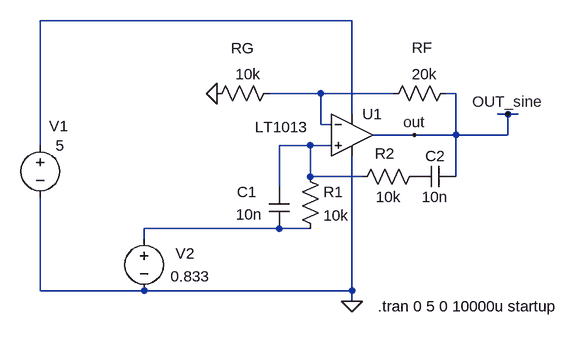
[diagram p0: schematic sine_wave_oscillators_8_wien_bridge_oscillator.asc]
sine_wave_oscillators_8_wien_bridge_oscillator.asc, the LTspice schematic file:
Version 4
SHEET 1 1496 680
WIRE 128 -16 -352 -16
WIRE 80 96 0 96
WIRE 192 96 80 96
WIRE 288 96 272 96
WIRE 128 128 128 -16
WIRE 368 128 352 128
WIRE 384 128 368 128
WIRE 80 144 80 96
WIRE 96 144 80 144
WIRE 224 160 160 160
WIRE 288 160 288 96
WIRE 288 160 224 160
WIRE 368 160 368 128
WIRE 368 160 288 160
WIRE -352 176 -352 -16
WIRE 64 176 16 176
WIRE 96 176 64 176
WIRE 64 224 64 176
WIRE 144 224 64 224
WIRE 288 224 288 160
WIRE 16 240 16 176
WIRE 16 304 -192 304
WIRE 64 304 16 304
WIRE -192 320 -192 304
WIRE -352 400 -352 256
WIRE -192 400 -352 400
WIRE 128 400 128 192
WIRE 128 400 -192 400
WIRE 128 416 128 400
FLAG 128 416 0
FLAG 368 128 OUT_sine
FLAG 224 160 out
FLAG -80 96 0
SYMBOL Opamps\\LT1013 128 96 R0
WINDOW 3 -149 52 Left 2
SYMATTR InstName U1
SYMBOL voltage -352 160 R0
WINDOW 0 14 -14 Left 2
WINDOW 3 24 16 Left 2
WINDOW 123 0 0 Left 2
WINDOW 39 0 0 Left 2
SYMATTR InstName V1
SYMATTR Value 5
SYMBOL res 288 80 R90
WINDOW 0 -39 52 VBottom 2
WINDOW 3 -29 48 VTop 2
SYMATTR InstName RF
SYMATTR Value 20k
SYMBOL cap 288 208 R90
WINDOW 0 0 32 VBottom 2
WINDOW 3 32 32 VTop 2
SYMATTR InstName C2
SYMATTR Value 10n
SYMBOL res 240 208 R90
WINDOW 0 -4 61 VBottom 2
WINDOW 3 32 56 VTop 2
SYMATTR InstName R2
SYMATTR Value 10k
SYMBOL res 48 208 R0
SYMATTR InstName R1
SYMATTR Value 10k
SYMBOL cap 32 304 R180
WINDOW 0 50 56 Left 2
WINDOW 3 42 22 Left 2
SYMATTR InstName C1
SYMATTR Value 10n
SYMBOL voltage -192 304 R0
WINDOW 0 48 38 Left 2
WINDOW 3 41 74 Left 2
WINDOW 123 0 0 Left 2
WINDOW 39 0 0 Left 2
SYMATTR InstName V2
SYMATTR Value 0.833
SYMBOL res 16 80 R90
WINDOW 0 -38 56 VBottom 2
WINDOW 3 -29 48 VTop 2
SYMATTR InstName RG
SYMATTR Value 10k
TEXT 168 424 Left 2 !.tran 0 5 0 10000u startup

The netlist it stands for:
* sine_wave_oscillators_8_wien_bridge_oscillator.asc
XU1 N003 N002 N001 0 out LT1013  ; pins In+ In- V+ V- OUT
V1 N001 0 5
RF out N002 20k
C2 out P001 10n
R2 P001 N003 10k
R1 N003 N004 10k
C1 N004 N003 10n
V2 N004 0 0.833
RG N002 0 10k
.tran 0 5 0 10000u startup
.lib LTC.lib
.backanno
.end